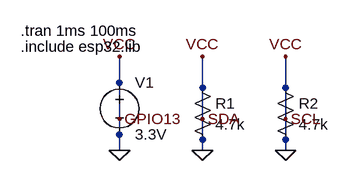
[diagram p0: schematic ext_mmwave_ltspice.asc]
ext_mmwave_ltspice.asc, the LTspice schematic file:
Version 4
SHEET 1 880 680
WIRE 208 112 208 64
WIRE 336 112 336 64
WIRE 464 112 464 64
WIRE 208 160 208 112
WIRE 336 160 336 112
WIRE 464 160 464 112
WIRE 208 208 208 160
WIRE 336 208 336 160
WIRE 464 208 464 160

FLAG 208 208 0
FLAG 336 208 0
FLAG 464 208 0
FLAG 208 64 VCC
FLAG 336 64 VCC
FLAG 464 64 VCC
FLAG 208 160 GPIO13
FLAG 336 160 SDA
FLAG 464 160 SCL

SYMBOL voltage 208 88 R0
WINDOW 123 0 0 Left 0
WINDOW 39 0 0 Left 0
SYMATTR InstName V1
SYMATTR Value 3.3V

SYMBOL res 320 96 R0
WINDOW 0 36 40 Left 2
WINDOW 3 36 72 Left 2
SYMATTR InstName R1
SYMATTR Value 4.7k

SYMBOL res 448 96 R0
WINDOW 0 36 40 Left 2
WINDOW 3 36 72 Left 2
SYMATTR InstName R2
SYMATTR Value 4.7k

TEXT 56 24 Left 2 !.tran 1ms 100ms
TEXT 56 48 Left 2 !.include esp32.lib

The netlist it stands for:
* ext_mmwave_ltspice.asc
V1 0 0 3.3V
R1 0 0 4.7k
R2 0 0 4.7k
.tran 1ms 100ms
.include esp32.lib
.backanno
.end